# EasyEDA Pro project ProProject_PetCareSTM32_MiniSTM32_2024-08-29_1.epro

# Schematic Schematic1
Create Date: 2024-08-11; Page Name: P1; Project Name: PetCareSTM32_MiniSTM32; Schematic Name: Schematic1; Update Date: 2024-08-25; Company: 嘉立创EDA; Page Size: A4; Version: V1.0
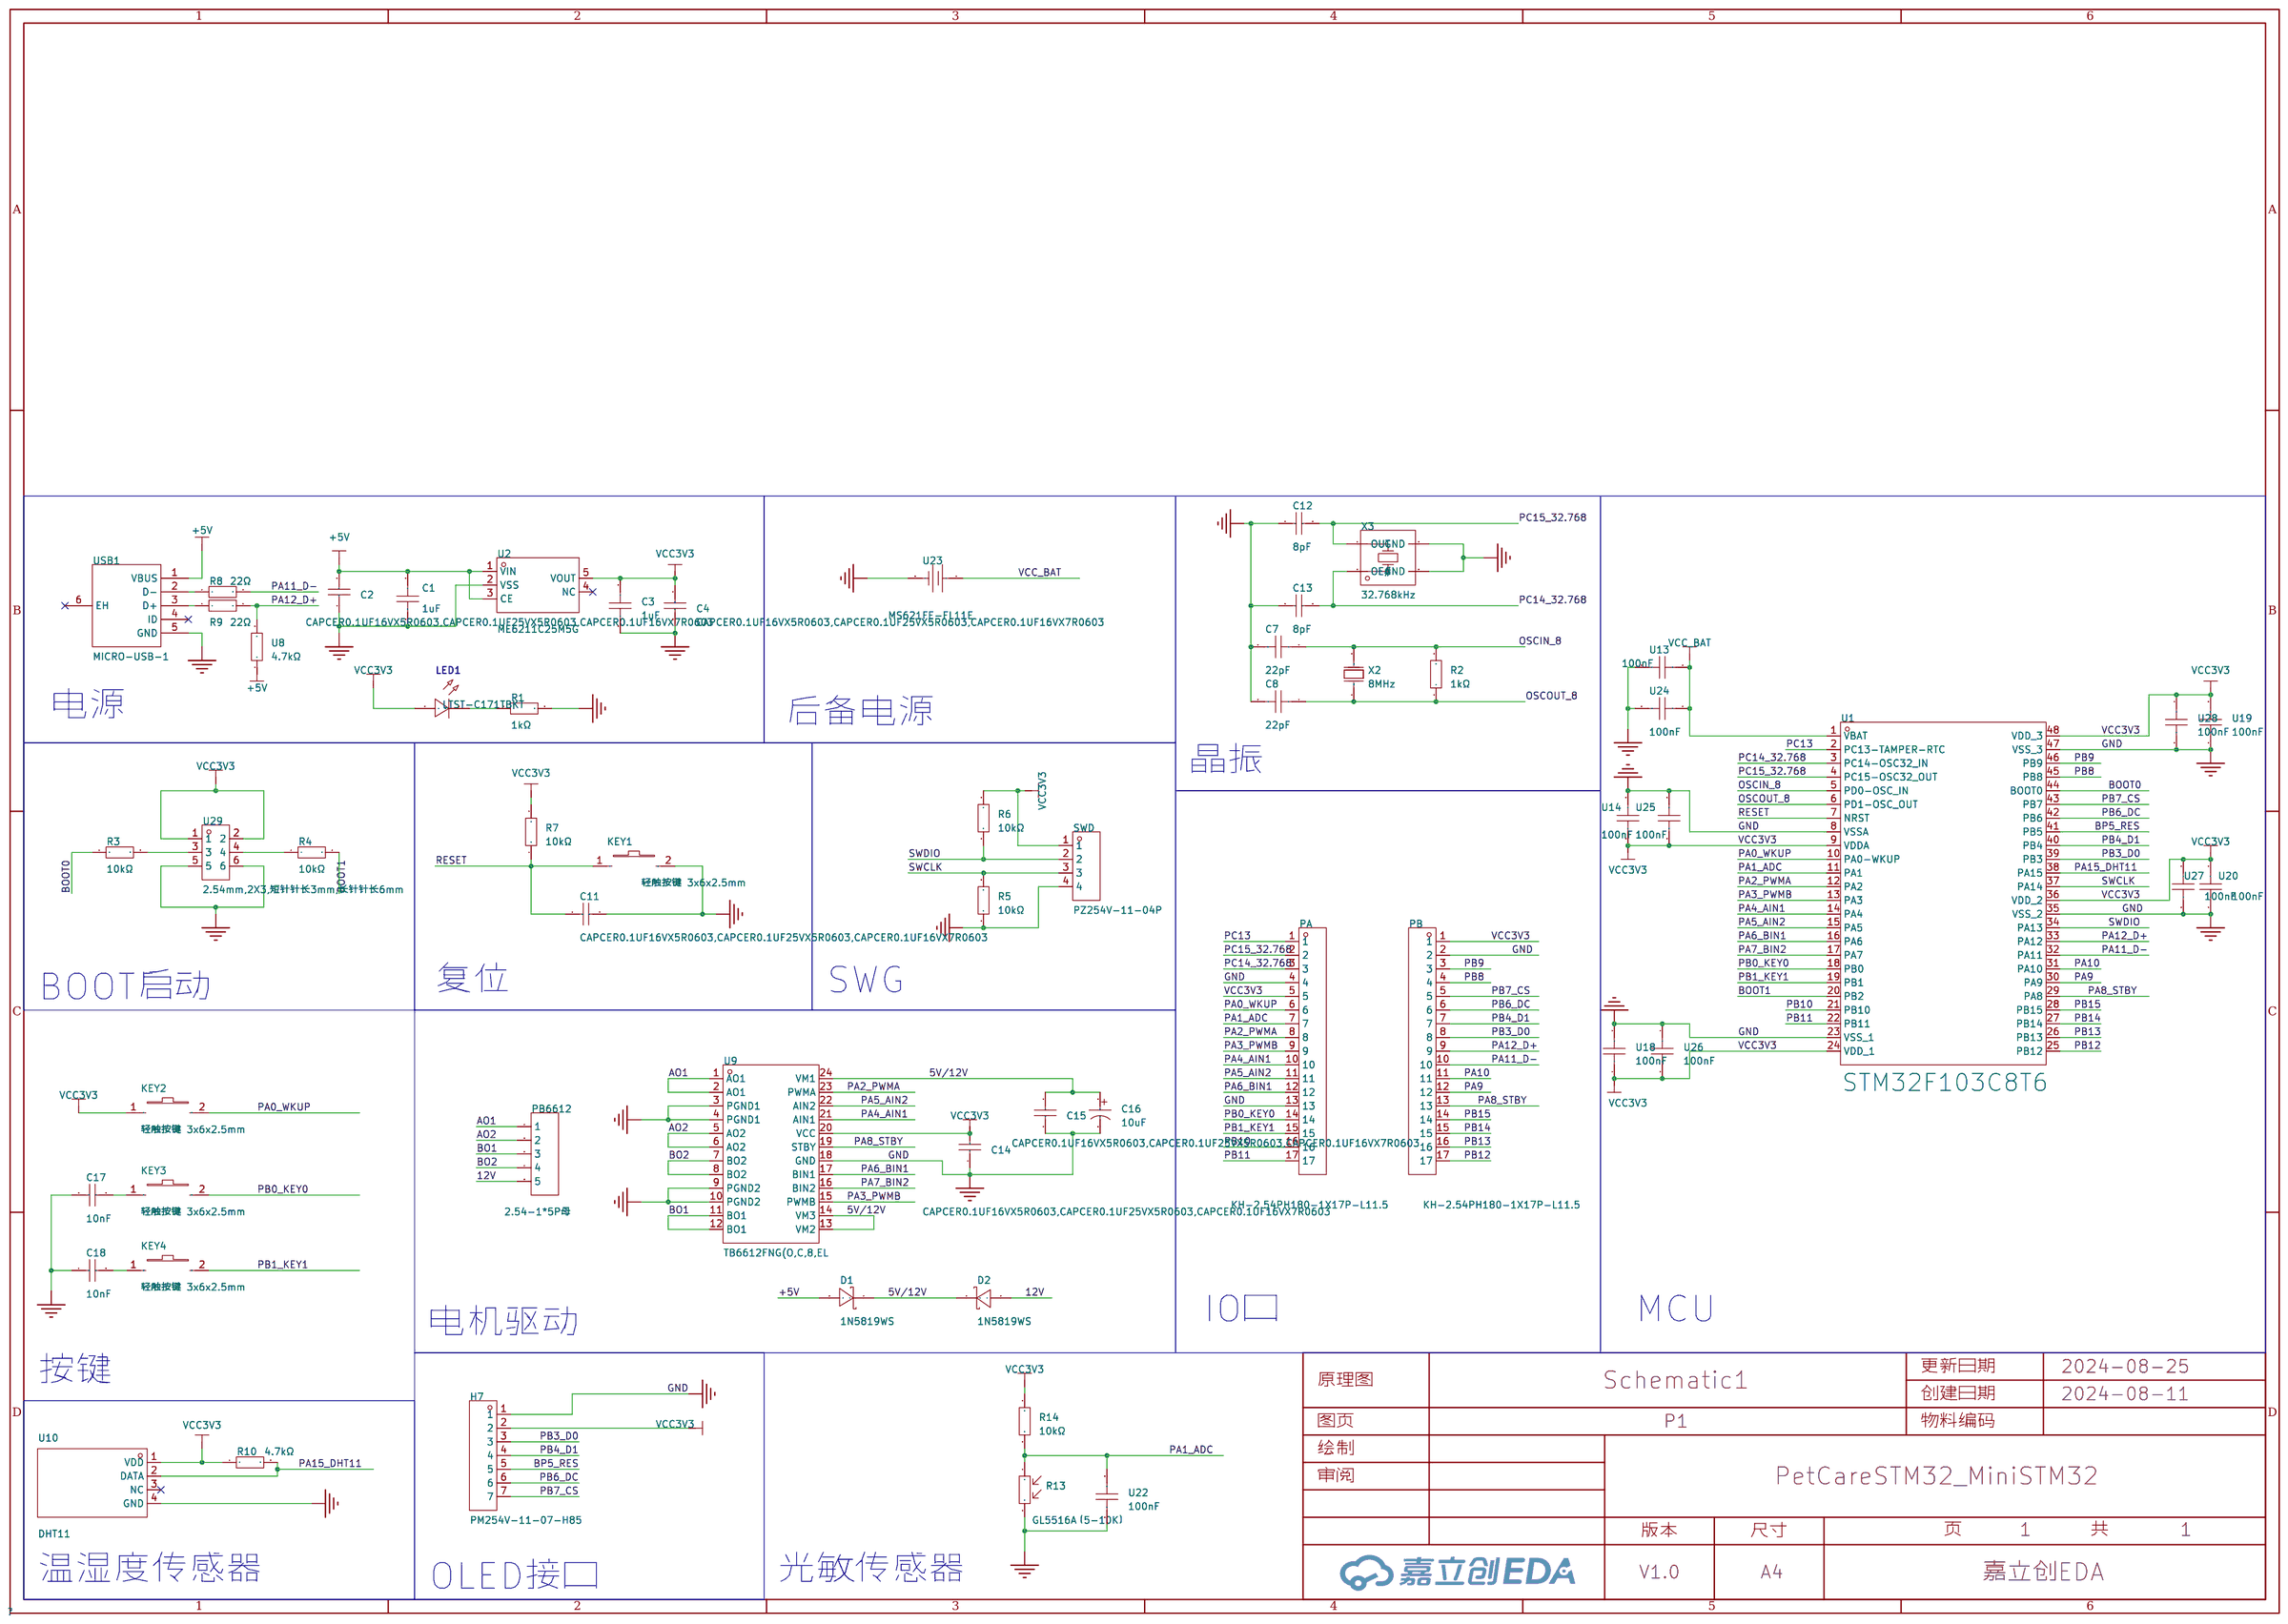
[diagram p0: schematic sheet]

## Parts
C1  1uF  [C0603]
C2  CAPCER0.1UF16VX5R0603,CAPCER0.1UF25VX5R0603,CAPCER0.1UF16VX7R0603  [C0603]
C3  1uF  [C0603]
C4  CAPCER0.1UF16VX5R0603,CAPCER0.1UF25VX5R0603,CAPCER0.1UF16VX7R0603  [C0603]
C7  22pF  [C0603]
C8  22pF  [C0603]
C11  CAPCER0.1UF16VX5R0603,CAPCER0.1UF25VX5R0603,CAPCER0.1UF16VX7R0603  [C0603]
C12  8pF  [C0603]
C13  8pF  [C0603]
C14  CAPCER0.1UF16VX5R0603,CAPCER0.1UF25VX5R0603,CAPCER0.1UF16VX7R0603  [C0603]
C15  CAPCER0.1UF16VX5R0603,CAPCER0.1UF25VX5R0603,CAPCER0.1UF16VX7R0603  [C0603]
C16  10uF  [CAP-TH_BD5.0-P2.00-D0.8-FD]
C17  10nF  [C0603]
C18  10nF  [C0603]
D1  1N5819WS  [SOD-323_L1.8-W1.3-LS2.5-RD]
D2  1N5819WS  [SOD-323_L1.8-W1.3-LS2.5-RD]
H7  PM254V-11-07-H85  [HDR-TH_7P-P2.54-V-F]
KEY1  轻触按键 3x6x2.5mm  [SW-SMD_L6.0-W3.6-LS8.0]
KEY2  轻触按键 3x6x2.5mm  [SW-SMD_L6.0-W3.6-LS8.0]
KEY3  轻触按键 3x6x2.5mm  [SW-SMD_L6.0-W3.6-LS8.0]
KEY4  轻触按键 3x6x2.5mm  [SW-SMD_L6.0-W3.6-LS8.0]
LED1  LTST-C171TBKT  [LED0805-RD_BLUE]
PA  KH-2.54PH180-1X17P-L11.5  [HDR-TH_17P-P2.54-V-M]
PB  KH-2.54PH180-1X17P-L11.5  [HDR-TH_17P-P2.54-V-M]
PB6612  2.54-1*5P母  [HDR-TH_5P-P2.54-V-F]
R1  1kΩ  [R0603]
R2  1kΩ  [R0603]
R3  10kΩ  [R0603]
R4  10kΩ  [R0603]
R5  10kΩ  [R0603]
R6  10kΩ  [R0603]
R7  10kΩ  [R0603]
R8  22Ω  [R0805]
R9  22Ω  [R0805]
R10  4.7kΩ  [R1206]
R13  GL5516A（5-10K）  [RES-TH_L5.1-W4.3-P3.40_GL55]
R14  10kΩ  [R0603]
SWD  PZ254V-11-04P  [HDR-TH_4P-P2.54-V-M]
U1  STM32F103C8T6  [LQFP-48_L7.0-W7.0-P0.50-LS9.0-BL]
U2  ME6211C25M5G  [SOT-23-5_L2.9-W1.7-P0.95-LS2.8-BL]
U8  4.7kΩ  [R0603]
U9  TB6612FNG(O,C,8,EL  [SSOP-24_L8.4-W5.8-P0.65-LS7.8-BL]
U10  DHT11  [SENSOR-TH_DHT11]
U13  100nF  [C0603]
U14  100nF  [C0603]
U18  100nF  [C0603]
U19  100nF  [C0603]
U20  100nF  [C0603]
U22  100nF  [C0603]
U23  MS621FE-FL11E  [BAT-SMD_FL11E]
U24  100nF  [C0603]
U25  100nF  [C0603]
U26  100nF  [C0603]
U27  100nF  [C0603]
U28  100nF  [C0603]
U29  2.54mm,2X3,短针针长3mm,长针针长6mm  [HDR-TH_6P-P2.54-V-M-R2-C3-S2.54-2]
USB1  MICRO-USB-1  [MICRO-USB-SMD_C9900008946]
X2  8MHz  [OSC-SMD_L5.0-W3.2]
X3  32.768kHz  [CRYSTAL-SMD_4P-L8.0-W3.8-BL]

## Library data of the parts
C1 C3 = CL10A105KB8NNNC: 容值:1uF;精度:±10%;额定电压:50V;材质(温度系数):X5R;; LCSC Part Name: 1uF ±10% 50V; Supplier Part: C15849; Manufacturer: SAMSUNG(三星); Supplier Footprint: 0603; JLCPCB Part Class: Basic Part; Datasheet: https://atta.szlcsc.com/upload/public/pdf/source/20160218/1457707763339.pdf; Supplier: LCSC; Tolerance: ±10%; Voltage Rated: 50V; Temperature Coefficient: X5R
C2 C4 C11 C14 C15 = CAPCER0.1UF16VX5R0603,CAPCER0.1UF25VX5R0603,CAPCER0.1UF16VX7R0603: Supplier Part: C9900012833; JLCPCB Part Class: Extended Part; Supplier: LCSC
C7 C8 = CL10C220JB81PNC: 容值:22pF;精度:±5%;额定电压:50V;材质(温度系数):C0G;; LCSC Part Name: 22pF ±5% 50V; Supplier Part: C170132; Manufacturer: SAMSUNG(三星); Supplier Footprint: 0603; JLCPCB Part Class: Extended Part; Datasheet: https://atta.szlcsc.com/upload/public/pdf/source/20180126/C170132_15169630833661310807.pdf; Supplier: LCSC; Tolerance: ±5%; Voltage Rated: 50V; Temperature Coefficient: C0G
C12 C13 = 0603CG8R0C500NT: 容值:8pF;额定电压:50V;材质(温度系数):C0G;; LCSC Part Name: 8pF 50V; Supplier Part: C36508; Manufacturer: FH(风华); Supplier Footprint: 0603; JLCPCB Part Class: Extended Part; Datasheet: https://atta.szlcsc.com/upload/public/pdf/source/20200305/C486355_26A10D38EF8C2A5C37091D0039909270.pdf; Supplier: LCSC; Voltage Rated: 50V; Temperature Coefficient: C0G
C16 = KF100M025C110A: 容值:10uF;精度:±20%;额定电压:25V;; LCSC Part Name: 10uF ±20% 25V; Supplier Part: C62930; Manufacturer: CapXon(丰宾); Supplier Footprint: 插件,D5xL11mm; JLCPCB Part Class: Extended Part; Datasheet: https://atta.szlcsc.com/upload/public/pdf/source/20160702/1467448308274.pdf; Supplier: LCSC; Tolerance: ±20%; Rated Voltage: 25V; Lead Spacing: 2mm; φD: 5mm; L: 11mm; Lifetime @ Temp: 2000hrs@105℃
C17 C18 = CC0603KRX7R9BB103: 容值:10nF;精度:±10%;额定电压:50V;材质(温度系数):X7R;; LCSC Part Name: 10nF ±10% 50V; Supplier Part: C100042; Manufacturer: YAGEO(国巨); Supplier Footprint: 0603; JLCPCB Part Class: Extended Part; Datasheet: https://atta.szlcsc.com/upload/public/pdf/source/20181008/C309510_22F155564471FAF6A489F7D68F34234E.pdf; Supplier: LCSC; Tolerance: ±10%; Voltage Rated: 50V; Temperature Coefficient: X7R
D1 D2 = 1N5819WS_C191023: 正向压降(Vf):600mV@1A;直流反向耐压(Vr):40V;平均整流电流(Io):1A;; LCSC Part Name: 电压:40V 电流:1A; Supplier Part: C191023; Manufacturer: Hottech(合科泰); Supplier Footprint: SOD-323; JLCPCB Part Class: Basic Part; Datasheet: https://atta.szlcsc.com/upload/public/pdf/source/20220428/3CB86FD8D28D653594B4E35F9D5AEFD9.pdf; Supplier: LCSC; Forward Voltage (Vf@If): 600mV@1A; Reverse Voltage (Vr): 40V; Average Rectified Current (Io): 1A
H7 = PM254V-11-07-H85: 插孔结构:1x7P;间距:2.54mm;行距:-;圆孔/方孔:方孔;安装类型:直插;排数:单排;总孔位数:7P;额定电流:3A;额定电压:250V;插孔方向:顶部;塑高:-;工作温度范围:-40℃~+105℃;; LCSC Part Name: 间距:2.54mm 1x7P 直插; Supplier Part: C2832270; Manufacturer: XFCN(兴飞); Supplier Footprint: 插件,P=2.54mm; JLCPCB Part Class: Extended Part; Datasheet: https://atta.szlcsc.com/upload/public/pdf/source/20210514/C2832270_F424CC0071A81298BFB56B53406F9842.pdf; Supplier: LCSC; Holes Structure: 1x7P; Pitch: 2.54mm; Circular Hole / Square Hole: 方孔; Mounting Type: 直插; Number of Rows: 单排; Number of Holes: 7P; Current Rating (Max): 3A; Voltage Rating (Max): 250V; Holes Direction: 顶部; Operating Temperature Range: -40℃~+105℃
KEY1-KEY4 = 轻触按键 3x6x2.5mm: LCSC Part Name: 3x6x2.5 红头 耐高温; Supplier Part: C5382; Supplier Footprint: SMD; JLCPCB Part Class: Extended Part; Supplier: LCSC
LED1 = LTST-C171TBKT: 发光颜色:蓝色;正向电压(VF):3.3V;功率:76mW;正向电流:20mA;主波长:465nm~475nm;二极管配置:-;透镜颜色:无色透明透镜;色温:-;发光强度:104mcd;发光角度:130°;载带方式:-;工作温度:-20℃~+80℃;; LCSC Part Name: 蓝灯; Supplier Part: C98225; Manufacturer: LITEON(光宝); Supplier Footprint: 0805; JLCPCB Part Class: Extended Part; Datasheet: https://atta.szlcsc.com/upload/public/pdf/source/20170818/C98225_1503051350955895434.pdf; Supplier: LCSC; Emitted Color: 蓝色; Forward Voltage (VF): 3.3V; Power Dissipation: 76mW; Forward Current: 20mA; Dominant Wavelength: 465nm~475nm; Peak Wavelength: 468nm; Lens Color: 无色透明透镜; Luminous Intensity: 104mcd; Viewing Angle: 130°; Operating Temperature: -20℃~+80℃
PA PB = KH-2.54PH180-1X17P-L11.5: 插针结构:1x17P;间距:2.54mm;行距:-;圆针/方针:方针;安装类型:直插;排数:单排;总PIN位数:17P;额定电流:3A;额定电压:-;配合针长度:6mm;塑高:2.5mm;端接针长度:3mm;工作温度范围:-40℃~+105℃;颜色:黑色;; LCSC Part Name: 间距:2.54mm 1x17P 直插 方针; Supplier Part: C2932705; Manufacturer: kinghelm(金航标); Supplier Footprint: 插件,P=2.54mm; JLCPCB Part Class: Extended Part; Datasheet: https://atta.szlcsc.com/upload/public/pdf/source/20211220/20932CDD9C2552710798341E35ADE8E4.pdf; Supplier: LCSC; Pin Structure: 1x17P; Pitch: 2.54mm; Circluar Pins/Square Pins: 方针; Mounting Type: 直插; Number of Rows: 单排; Number of Pins: 17P; Current Rating (Max): 3A; Length of Mating Pin: 6mm; Insulation Height: 2.5mm; Length of End Connection Pin: 3mm; Operating Temperature Range: -40℃~+105℃; Color: 黑色
PB6612 = 2.54-1*5P母: 插孔结构:1x5P;间距:2.54mm;行距:-;安装类型:直插;排数:单排;总孔位数:5P;塑高:-;触头材质:-;触头镀层:-;; LCSC Part Name: 间距:2.54mm 1x5P 直插; Supplier Part: C50950; Manufacturer: BOOMELE(博穆精密); Supplier Footprint: 插件,P=2.54mm; JLCPCB Part Class: Extended Part; Datasheet: https://atta.szlcsc.com/upload/public/pdf/source/20210301/C2718488_F4427B881E42CAA8DDB0B1C12B3A522C.pdf; Supplier: LCSC; Holes Structure: 1x5P; Pitch: 2.54mm; Mounting Type: 直插; Number of Rows: 单排; Number of Holes: 5P
R1 = RC0603FR-071KL: 电阻类型:厚膜电阻;阻值:1kΩ;精度:±1%;功率:100mW;最大工作电压:75V;温度系数:±100ppm/℃;; LCSC Part Name: 厚膜电阻 1kΩ ±1% 100mW; Supplier Part: C22548; Manufacturer: YAGEO(国巨); Supplier Footprint: 0603; JLCPCB Part Class: Extended Part; Datasheet: https://atta.szlcsc.com/upload/public/pdf/source/20180316/70C0E2BDAE7FCC62C531A5A58D202EE1.pdf; Supplier: LCSC; Type: 厚膜电阻; Tolerance: ±1%; Power(Watts): 100mW; Overload Voltage (Max): 75V; Temperature Coefficient: ±100ppm/℃; Operating Temperature Range: -55℃~+155℃
R2 = 0603WAD1001T5E: 电阻类型:厚膜电阻;阻值:1kΩ;精度:±0.5%;功率:100mW;最大工作电压:75V;温度系数:±100ppm/℃;; LCSC Part Name: 1kΩ ±0.5% 100mW 厚膜电阻; Supplier Part: C51218; Manufacturer: UNI-ROYAL(厚声); Supplier Footprint: 0603; JLCPCB Part Class: Extended Part; Datasheet: https://atta.szlcsc.com/upload/public/pdf/source/20200306/C422600_1E6D84923E4A46A82E41ADD87F860B5C.pdf; Supplier: LCSC; Type: 厚膜电阻; Tolerance: ±0.5%; Power(Watts): 100mW; Overload Voltage (Max): 75V; Temperature Coefficient: ±100ppm/℃; Operating Temperature Range: -55℃~+155℃
R3-R7 R14 = 0603WAF1002T5E: 电阻类型:厚膜电阻;阻值:10kΩ;精度:±1%;功率:100mW;最大工作电压:75V;温度系数:±100ppm/℃;; LCSC Part Name: 厚膜电阻 10kΩ ±1% 100mW; Supplier Part: C25804; Manufacturer: UNI-ROYAL(厚声); Supplier Footprint: 0603; JLCPCB Part Class: Basic Part; Datasheet: https://atta.szlcsc.com/upload/public/pdf/source/20200306/C422600_1E6D84923E4A46A82E41ADD87F860B5C.pdf; Supplier: LCSC; Type: 厚膜电阻; Tolerance: ±1%; Power(Watts): 100mW; Overload Voltage (Max): 75V; Temperature Coefficient: ±100ppm/℃; Operating Temperature Range: -55℃~+155℃
R8 R9 = TC0525F220JT5E: 电阻类型:薄膜电阻;阻值:22Ω;精度:±1%;功率:250mW;最大工作电压:150V;温度系数:±25ppm/℃;; LCSC Part Name: 22Ω ±1% 250mW 薄膜电阻; Supplier Part: C65068; Manufacturer: UNI-ROYAL(厚声); Supplier Footprint: 0805; JLCPCB Part Class: Extended Part; Datasheet: https://atta.szlcsc.com/upload/public/pdf/source/20190904/C425668_F2F639A313B6F33D501F342892FD5229.pdf; Supplier: LCSC; Type: 薄膜电阻; Tolerance: ±1%; Power(Watts): 250mW; Overload Voltage (Max): 150V; Temperature Coefficient: ±25ppm/℃; Operating Temperature Range: -55℃~+155℃
R10 = 1206W4F4701T5E: 电阻类型:厚膜电阻;阻值:4.7kΩ;精度:±1%;功率:250mW;最大工作电压:200V;温度系数:±100ppm/℃;; LCSC Part Name: 4.7kΩ ±1% 250mW 厚膜电阻; Supplier Part: C17936; Manufacturer: UNI-ROYAL(厚声); Supplier Footprint: 1206; JLCPCB Part Class: Basic Part; Datasheet: https://atta.szlcsc.com/upload/public/pdf/source/20200306/C422600_1E6D84923E4A46A82E41ADD87F860B5C.pdf; Supplier: LCSC; Type: 厚膜电阻; Tolerance: ±1%; Power(Watts): 250mW; Overload Voltage (Max): 200V; Temperature Coefficient: ±100ppm/℃; Operating Temperature Range: -55℃~+155℃
R13 = GL5516A（5-10K）: 暗电阻:200kΩ;亮电阻 @ 10Lux:5kΩ~10kΩ;光谱峰值(波长):540nm;; LCSC Part Name: 亮电阻:5kΩ~10kΩ 暗电阻:200kΩ; Supplier Part: C11307; Manufacturer: JCHL(晶创和立); Supplier Footprint: 插件,P=3.4mm; JLCPCB Part Class: Extended Part; Datasheet: https://atta.szlcsc.com/upload/public/pdf/source/20200417/C515010_C10502EF7F431E893A7F20DB83F527F0.pdf; Supplier: LCSC; Dark Resistance: 200kΩ; Illuminated Resistance @ 10Lux: 5kΩ~10kΩ; Applied Voltage: 150V; Spectral Peak: 540nm
SWD = PZ254V-11-04P: 插针结构:1x4P;间距:2.54mm;行距:-;圆针/方针:方针;安装类型:直插;排数:单排;总PIN位数:4P;额定电流:3A;额定电压:250V;配合针长度:6mm;塑高:2.5mm;端接针长度:3mm;触头材质:-;工作温度范围:-40℃~+105℃;颜色:黑色;; LCSC Part Name: 间距:2.54mm 1x4P 直插 方针; Supplier Part: C2691448; Manufacturer: XFCN(兴飞); Supplier Footprint: 插件,P=2.54mm; JLCPCB Part Class: Extended Part; Datasheet: https://atta.szlcsc.com/upload/public/pdf/source/20200309/C492403_F9F19131791D08044AD4F84F8E751A34.pdf; Supplier: LCSC; Pin Structure: 1x4P; Pitch: 2.54mm; Circluar Pins/Square Pins: 方针; Mounting Type: 直插; Number of Rows: 单排; Number of Pins: 4P; Current Rating (Max): 3A; Voltage Rating (Max): 250V; Length of Mating Pin: 6mm; Insulation Height: 2.5mm; Length of End Connection Pin: 3mm; Operating Temperature Range: -40℃~+105℃; Color: 黑色
U1 = STM32F103C8T6: CPU内核:ARM-M3;程序存储容量:64KB;RAM总容量:20KB;GPIO端口数量:37;工作电压范围:2V~3.6V;CPU最大主频:72MHz;程序存储器类型:FLASH;; LCSC Part Name: 主流增强型ARM Cortex-M3 MCU，具有64 KB Flash、72 MHz CPU、电机控制、USB和CAN; Supplier Part: C8734; Manufacturer: ST(意法半导体); Supplier Footprint: LQFP-48(7x7); JLCPCB Part Class: 扩展库; Datasheet: https://atta.szlcsc.com/upload/public/pdf/source/20220812/8363ACEC51AD55ECEB84799464F7CB85.pdf; Supplier: LCSC; CPU Core: ARM-M3; Program Storage Size: 64KB; RAM Size: 20KB; GPIO Ports Number: 37; Operating Voltage Range: 2V~3.6V; CPU Maximum Speed: 72MHz; Program Memory Type: FLASH; Operating Temperature Range: -40℃~+85℃; ADC (Bit): 12bit; Universal Serial Bus: 有; Peripheral/Function: 看门狗；DMA；看门狗；温度传感器; Watchdog: 有; Infrared Data Association: 有; Low-Voltage Detect: 有; Direct Memory Access: 有; Internal Oscillator: 有
U2 = ME6211C25M5G: LCSC Part Name: ME6211C25M5G 停产; Supplier Part: C2835813; Manufacturer: MICRONE(南京微盟); Supplier Footprint: SOT-23-5; JLCPCB Part Class: Extended Part; Datasheet: https://atta.szlcsc.com/upload/public/pdf/source/20211210/ACC7C3E9BA56F250BF966425916E32B9.pdf; Supplier: LCSC
U8 = AR03FTDX4701A: 电阻类型:薄膜电阻;阻值:4.7kΩ;精度:±1%;功率:100mW;最大工作电压:75V;温度系数:±50ppm/℃;; LCSC Part Name: 薄膜电阻 4.7kΩ ±1% 100mW; Supplier Part: C2924150; Manufacturer: Viking(光颉); Supplier Footprint: 0603; JLCPCB Part Class: Extended Part; Datasheet: https://atta.szlcsc.com/upload/public/pdf/source/20211123/7AFDB03DAF68AA91648A852AAE26A3AB.pdf; Supplier: LCSC; Type: 薄膜电阻; Tolerance: ±1%; Power(Watts): 100mW; Overload Voltage (Max): 75V; Temperature Coefficient: ±50ppm/℃; Operating Temperature Range: -55℃~+155℃
U9 = TB6612FNG(O,C,8,EL: 双直流电机驱动器集成电路; Supplier Part: C88224; Manufacturer: TOSHIBA(东芝); Supplier Footprint: SSOP-24-208mil; JLCPCB Part Class: Extended Part; Datasheet: https://atta.szlcsc.com/upload/public/pdf/source/20171128/C141517_15118625624231147036.pdf; Supplier: LCSC
U10 = DHT11: 新款电容式数字温湿度传感器,老款已停产16.1x12.6x5.8mm; LCSC Part Name: DHT11  电容式传感器; Supplier Part: C117051; Manufacturer: 广州奥松; Supplier Footprint: SIP-4; JLCPCB Part Class: Extended Part; Datasheet: https://atta.szlcsc.com/upload/public/pdf/source/20170703/1499081238365.pdf; Supplier: LCSC
U13 U14 U18-U20 U22 U24-U28 = CGA0603X7R104K500JT: 容值:100nF;精度:±10%;额定电压:50V;材质(温度系数):X7R;; LCSC Part Name: 100nF ±10% 50V; Supplier Part: C6119867; Manufacturer: HRE(芯声); Supplier Footprint: 0603; JLCPCB Part Class: Extended Part; Supplier: LCSC; Tolerance: ±10%; Voltage Rated: 50V; Temperature Coefficient: X7R
U23 = MS621FE-FL11E: FL11E 3.3V可充电纽扣电池 5.5mAH; LCSC Part Name: Seiko/精工，可充电纽扣电池，3V，MS621FE-FL11E，1个; Supplier Part: C80909; Manufacturer: Seiko(精工); JLCPCB Part Class: Extended Part; Datasheet: https://atta.szlcsc.com/upload/public/pdf/source/20230719/88F2811CC6B30DD05F1C5A5953BF9E77.pdf; Supplier: LCSC; voltage: 3 V; capacity: 5.5mAh; chemical composition: 锂离子; temperature range: -20-60°C; type: 纽扣; characteristic: 可充电; Packaging quantity: 1; Battery capacity: -；-；-
U29 = 2.54mm,2X3,短针针长3mm,长针针长6mm: Supplier Part: C9900024418; Supplier Footprint: 2X3; JLCPCB Part Class: Extended Part; Supplier: LCSC
USB1 = MICRO-USB-1: Supplier Part: C9900008946; Supplier Footprint: USB-micro; JLCPCB Part Class: Extended Part; Supplier: LCSC
X2 = ABM3-8.000MHZ-D2Y-T: 晶振类型:贴片晶振;频率:8MHz;常温频差:±20ppm;外接负载电容:18pF;频率稳定度(全温):±30ppm;; LCSC Part Name: 8MHz ±20ppm 18pF; Supplier Part: C144380; Manufacturer: ABRACON; Supplier Footprint: SMD5032; JLCPCB Part Class: Extended Part; Datasheet: https://atta.szlcsc.com/upload/public/pdf/source/20180613/C148313_0A3B1F233FF88ED3B220BE4C181ABF14.pdf; Supplier: LCSC; Crystal Type: 贴片晶振; Normal temperature Frequency Tolerance: ±20ppm; External load capacitor: 18pF; Frequency Stability(Full temperature range): ±30ppm; Equivalent Series Resistance (ESR): 140Ω; Operating Temperature: -40℃~+85℃
X3 = ABS25-32.768KHZ-T: 晶振类型:-;频率:32.768kHz;常温频差:±20ppm;外接负载电容:12.5pF;频率稳定度(全温):-;; LCSC Part Name: 32.768kHz ±20ppm 12.5pF; Supplier Part: C179637; Manufacturer: ABRACON; Supplier Footprint: MC-306; JLCPCB Part Class: 扩展库; Datasheet: https://atta.szlcsc.com/upload/public/pdf/source/20180207/C179637_15179896523281356363.pdf; Supplier: LCSC; Normal temperature Frequency Tolerance: ±20ppm; External load capacitor: 12.5pF; Equivalent Series Resistance (ESR): 50kΩ; Operating Temperature: -40℃~+85℃

## Nets
5V/12V: C15.2 C16.1 D1.1(K) D2.1(K) U9.13(VM2) U9.14(VM3) U9.24(VM1)
12V: D2.2(A) PB6612.5
+5V: C1.2 C2.2 D1.2(A) U2.1(VIN) U2.3(CE) U8.1 USB1.1(VBUS)
GND: C1.1 C2.1 C3.1 C4.1 C7.2 C8.2 C11.2 C12.1 C13.1 C14.1 C15.1 C16.2 C17.2 C18.1 H7.1 KEY1.2 PA.4 PA.13 PB.2 R1.2 R5.1 R13.2 SWD.4 U1.8(VSSA) U1.23(VSS_1) U1.35(VSS_2) U1.47(VSS_3) U2.2(VSS) U9.3(PGND1) U9.4(PGND1) U9.9(PGND2) U9.10(PGND2) U9.18(GND) U10.4(GND) U13.2 U14.2 U18.2 U19.1 U20.1 U22.1 U23.2(-) U24.2 U25.1 U26.1 U27.2 U28.2 U29.5 U29.6 USB1.5(GND) X3.2(GND) X3.3(GND)
VCC3V3: C3.2 C4.2 C14.2 H7.2 KEY2.1 LED1.2(A) PA.5 PB.1 R6.2 R7.2 R10.1 R14.2 SWD.1 U1.9(VDDA) U1.24(VDD_1) U1.36(VDD_2) U1.48(VDD_3) U2.5(VOUT) U9.20(VCC) U10.1(VDD) U14.1 U18.1 U19.2 U20.2 U25.2 U26.2 U27.1 U28.1 U29.1 U29.2
VCC_BAT: U1.1(VBAT) U13.1 U23.1(+) U24.1
AO1: PB6612.1 U9.1(AO1) U9.2(AO1)
AO2: PB6612.2 U9.5(AO2) U9.6(AO2)
BO1: PB6612.3 U9.11(BO1) U9.12(BO1)
BO2: PB6612.4 U9.7(BO2) U9.8(BO2)
BOOT0: R3.1 U1.44(BOOT0)
BOOT1: R4.2 U1.20(PB2)
BP5_RES: H7.5 U1.41(PB5)
OSCIN_8: C7.1 R2.2 U1.5(PD0-OSC_IN) X2.2(OSC2)
OSCOUT_8: C8.1 R2.1 U1.6(PD1-OSC_OUT) X2.1(OSC1)
PA0_WKUP: KEY2.2 PA.6 U1.10(PA0-WKUP)
PA1_ADC: PA.7 R13.1 R14.1 U1.11(PA1) U22.2
PA2_PWMA: PA.8 U1.12(PA2) U9.23(PWMA)
PA3_PWMB: PA.9 U1.13(PA3) U9.15(PWMB)
PA4_AIN1: PA.10 U1.14(PA4) U9.21(AIN1)
PA5_AIN2: PA.11 U1.15(PA5) U9.22(AIN2)
PA6_BIN1: PA.12 U1.16(PA6) U9.17(BIN1)
PA7_BIN2: U1.17(PA7) U9.16(BIN2)
PA8_STBY: PB.13 U1.29(PA8) U9.19(STBY)
PA9: PB.12 U1.30(PA9)
PA10: PB.11 U1.31(PA10)
PA11_D-: PB.10 R8.2 U1.32(PA11)
PA12_D+: PB.9 R9.2 U1.33(PA12) U8.2
PA15_DHT11: R10.2 U1.38(PA15) U10.2(DATA)
PB0_KEY0: KEY3.2 PA.14 U1.18(PB0)
PB1_KEY1: KEY4.2 PA.15 U1.19(PB1)
PB3_D0: H7.3 PB.8 U1.39(PB3)
PB4_D1: H7.4 PB.7 U1.40(PB4)
PB6_DC: H7.6 PB.6 U1.42(PB6)
PB7_CS: H7.7 PB.5 U1.43(PB7)
PB8: PB.4 U1.45(PB8)
PB9: PB.3 U1.46(PB9)
PB10: PA.16 U1.21(PB10)
PB11: PA.17 U1.22(PB11)
PB12: PB.17 U1.25(PB12)
PB13: PB.16 U1.26(PB13)
PB14: PB.15 U1.27(PB14)
PB15: PB.14 U1.28(PB15)
PC13: PA.1 U1.2(PC13-TAMPER-RTC)
PC14_32.768: C13.2 PA.3 U1.3(PC14-OSC32_IN) X3.1(OE#)
PC15_32.768: C12.2 PA.2 U1.4(PC15-OSC32_OUT) X3.4(OUT)
RESET: C11.1 KEY1.1 R7.1 U1.7(NRST)
SWCLK: R5.2 SWD.3 U1.37(PA14)
SWDIO: R6.1 SWD.2 U1.34(PA13)
$1N4524: LED1.1(C) R1.1
$1N8192: R8.1 USB1.2(D-)
$1N8237: R9.1 USB1.3(D+)
$1N32184: C17.1 KEY3.1
$1N32195: C18.2 KEY4.1
Net-(R3-2): R3.2 U29.3
Net-(R4-1): R4.1 U29.4

Not connected (* = marked no-connect by the designer): U2 4(NC)*; U10 3(NC)*; USB1 4(ID)* 6(EH)*

## Notes on the sheet
- 电源
- 后备电源
- 晶振
- BOOT启动
- 复位
- SWG
- IO口
- MCU
- 电机驱动
- 按键
- 温湿度传感器
- 光敏传感器
- OLED接口

# Board PCB1
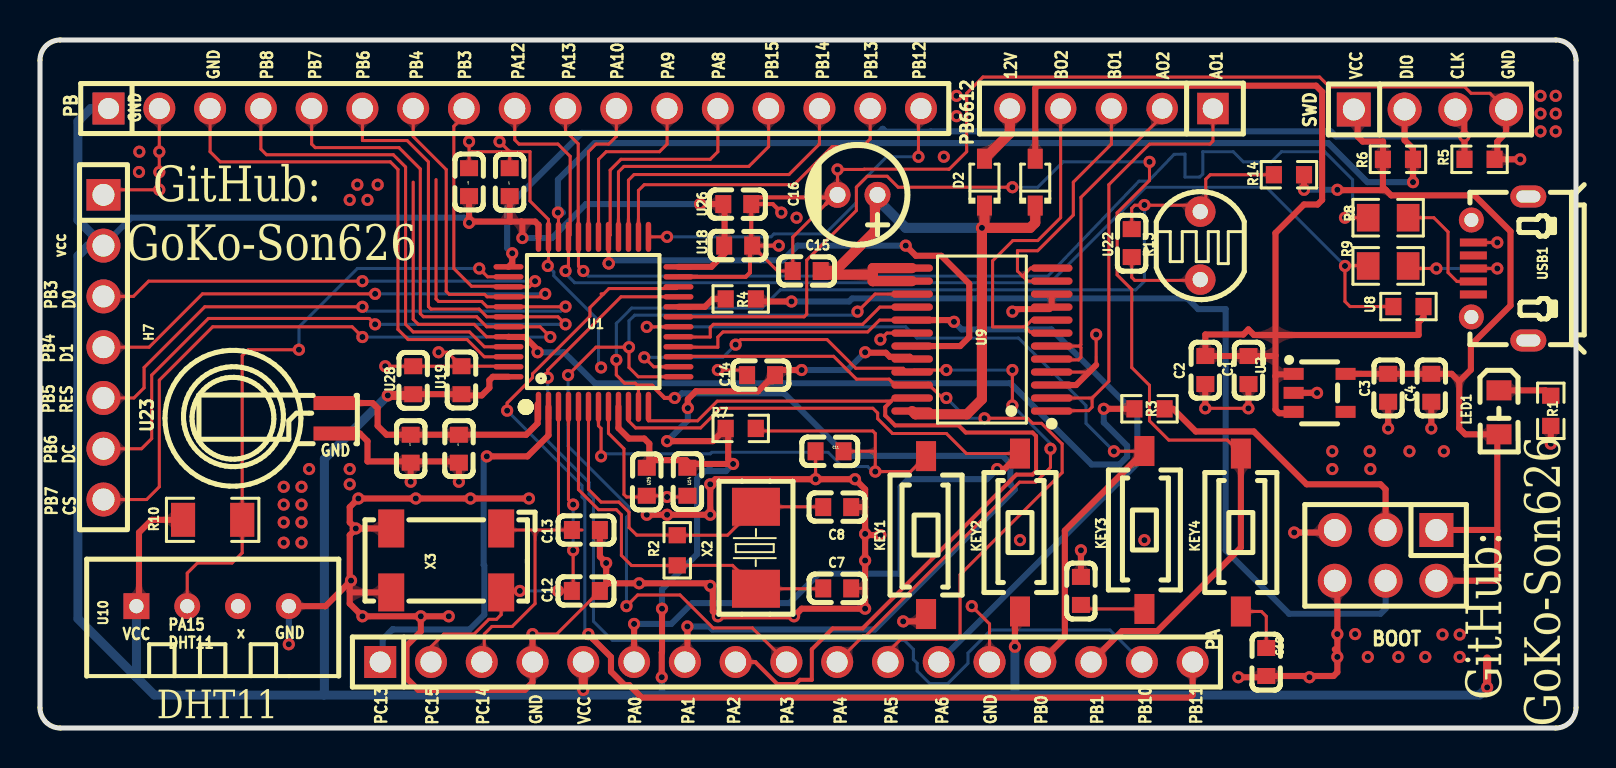
[diagram p1: board, top side]
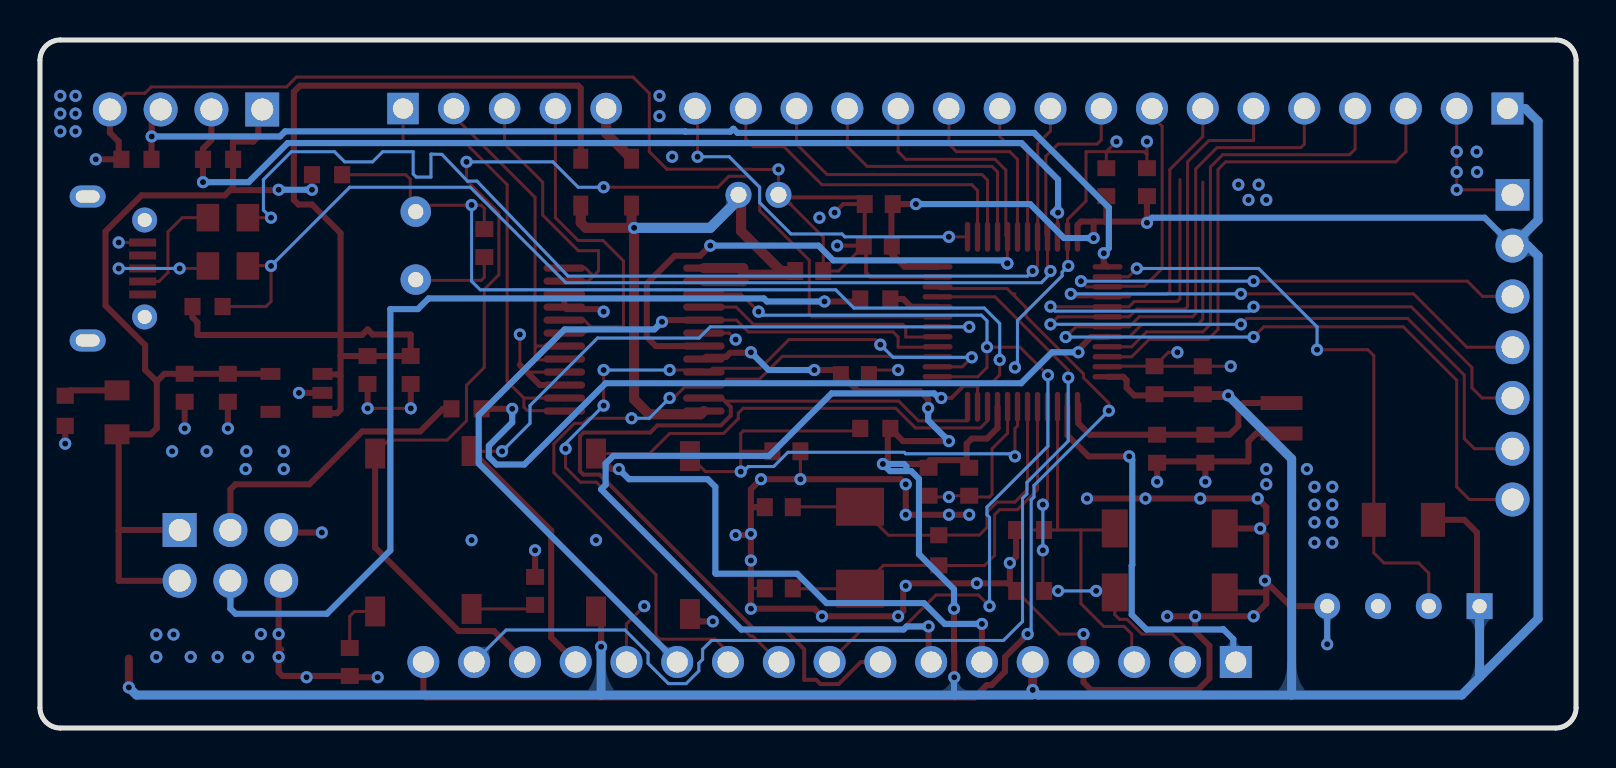
[diagram p2: board, bottom side, seen from below]

Outline 76.84 x 34.42 mm; copper layers: Top Layer, Bottom Layer. Coordinates in mm from the lower left corner of the outline.
Outline path: 0,33.4 0,1.02 arc(0.3,0.3) 1.02,0 75.82,0 arc(76.54,0.3) 76.84,1.02 76.84,33.4 arc(76.54,34.12) 75.82,34.42 1.02,34.42 arc(0.3,34.12) 0,33.4
Stack: Top Layer 0.035mm / Dielectric1 1.51mm FR4 er 4.5 / Bottom Layer 0.035mm

## Design rules (mm)
net PA11_D-: DP2
net PA12_D+: DP2
net $1N8192: DP1
net $1N8237: DP1
template: 自定义配置
spacing copperThickness1oz (default): track to track 0.203, other pairs 0.203 to 0.203
spacing copperThickness2oz: track to track 0.203, other pairs 0.152 to 0.3
track width copperThickness1oz (default): min 0.152, default 0.152, max 0.305
track width copperThickness2oz: min 0.203, default 0.254, max 2.54
track width 5V: min 0.305, default 0.305, max 0.762
track width 12V: min 0.508, default 0.508, max 0.762
differential pair differentialPair (default): width min 0.152, default 0.152, max 0.152; gap min 0.152, default 0.152
via viaSize (default): diameter min 0.61, default 0.61, max 0.61; hole min 0.305, default 0.305, max 0.305
net VCC_BAT uses 5V
net VCC3V3 uses 5V
net +5V uses 5V
net 5V/12V uses 12V
net 12V uses 12V

## Placement (name value [footprint] x y rotation side)
BOOT  2.54mm,2X3,短针针长3mm,长针针长6mm  [HDR-TH_6P-P2.54-V-M-R2-C3-S2.54-2]  67.31 8.64 180 top
C1  1uF  [C0603]  60.45 17.91 90 top
C2  CAPCER0.1UF16VX5R0603,CAPCER0.1UF25VX5R0603,CAPCER0.1UF16VX7R0603  [C0603]  58.29 17.91 90 top
C3  1uF  [C0603]  67.44 17.02 90 top
C4  CAPCER0.1UF16VX5R0603,CAPCER0.1UF25VX5R0603,CAPCER0.1UF16VX7R0603  [C0603]  69.6 17.02 90 top
C7  22pF  [C0603]  39.88 6.98 0 top
C8  22pF  [C0603]  39.88 11.05 0 top
C11  CAPCER0.1UF16VX5R0603,CAPCER0.1UF25VX5R0603,CAPCER0.1UF16VX7R0603  [C0603]  39.5 13.84 180 top
C12  8pF  [C0603]  27.31 6.86 180 top
C13  8pF  [C0603]  27.31 9.91 180 top
C14  CAPCER0.1UF16VX5R0603,CAPCER0.1UF25VX5R0603,CAPCER0.1UF16VX7R0603  [C0603]  36.07 17.65 0 top
C15  CAPCER0.1UF16VX5R0603,CAPCER0.1UF25VX5R0603,CAPCER0.1UF16VX7R0603  [C0603]  38.35 22.86 0 top
C16  10uF  [CAP-TH_BD5.0-P2.00-D0.8-FD]  40.89 26.67 180 top
C17  10nF  [C0603]  52.07 6.86 90 top
C18  10nF  [C0603]  61.34 3.3 90 top
D1  1N5819WS  [SOD-323_L1.8-W1.3-LS2.5-RD]  49.78 27.3 90 top
D2  1N5819WS  [SOD-323_L1.8-W1.3-LS2.5-RD]  47.24 27.3 90 top
H7  PM254V-11-07-H85  [HDR-TH_7P-P2.54-V-F]  3.17 19.05 270 top
KEY1  轻触按键 3x6x2.5mm  [SW-SMD_L6.0-W3.6-LS8.0]  44.32 9.65 270 top
KEY2  轻触按键 3x6x2.5mm  [SW-SMD_L6.0-W3.6-LS8.0]  49.02 9.78 90 top
KEY3  轻触按键 3x6x2.5mm  [SW-SMD_L6.0-W3.6-LS8.0]  55.25 9.91 90 top
KEY4  轻触按键 3x6x2.5mm  [SW-SMD_L6.0-W3.6-LS8.0]  60.07 9.78 90 top
LED1  LTST-C171TBKT  [LED0805-RD_BLUE]  72.98 15.79 270 top
PA  KH-2.54PH180-1X17P-L11.5  [HDR-TH_17P-P2.54-V-M]  37.34 3.3 0 top
PB  KH-2.54PH180-1X17P-L11.5  [HDR-TH_17P-P2.54-V-M]  23.75 30.99 0 top
PB6612  2.54-1*5P母  [HDR-TH_5P-P2.54-V-F]  53.59 30.99 180 top
R1  1kΩ  [R0603]  75.57 15.87 270 top
R2  1kΩ  [R0603]  31.88 8.89 270 top
R3  10kΩ  [R0603]  55.5 15.97 0 top
R4  10kΩ  [R0603]  35.05 21.46 180 top
R5  10kΩ  [R0603]  72.01 28.45 180 top
R6  10kΩ  [R0603]  67.93 28.45 180 top
R7  10kΩ  [R0603]  35.05 14.99 180 top
R8  22Ω  [R0805]  67.44 25.53 180 top
R9  22Ω  [R0805]  67.44 23.11 180 top
R10  4.7kΩ  [R1206]  8.64 10.41 0 top
R13  GL5516A（5-10K）  [RES-TH_L5.1-W4.3-P3.40_GL55]  58.04 24.13 0 top
R14  10kΩ  [R0603]  62.48 27.68 0 top
SWD  PZ254V-11-04P  [HDR-TH_4P-P2.54-V-M]  69.53 30.94 0 top
U1  STM32F103C8T6  [LQFP-48_L7.0-W7.0-P0.50-LS9.0-BL]  27.69 20.32 0 top
U2  ME6211C25M5G  [SOT-23-5_L2.9-W1.7-P0.95-LS2.8-BL]  64.01 16.76 270 top
U8  4.7kΩ  [R0603]  68.45 21.08 180 top
U9  TB6612FNG(O,C,8,EL  [SSOP-24_L8.4-W5.8-P0.65-LS7.8-BL]  47.12 19.43 90 top
U10  DHT11  [SENSOR-TH_DHT11]  8.64 6.1 0 top
U13  100nF  [C0603]  18.54 13.97 270 top
U14  100nF  [C0603]  32.38 12.32 270 top
U18  100nF  [C0603]  34.93 24.13 0 top
U19  100nF  [C0603]  21.08 17.4 270 top
U20  100nF  [C0603]  21.46 27.3 270 top
U22  100nF  [C0603]  54.61 24.26 90 top
U23  MS621FE-FL11E  [BAT-SMD_FL11E]  14.73 15.49 0 top
U24  100nF  [C0603]  20.96 13.97 270 top
U25  100nF  [C0603]  30.35 12.32 90 top
U26  100nF  [C0603]  34.88 26.21 180 top
U27  100nF  [C0603]  23.5 27.3 90 top
U28  100nF  [C0603]  18.67 17.4 90 top
USB1  MICRO-USB-1  [MICRO-USB-SMD_C9900008946]  73.03 22.99 90 top
X2  8MHz  [OSC-SMD_L5.0-W3.2]  35.81 9.02 270 top
X3  32.768kHz  [CRYSTAL-SMD_4P-L8.0-W3.8-BL]  20.32 8.38 180 top

## Footprints (pads in the part's own frame, mm; a bottom-side part is the same pattern mirrored in y, then rotated)
BAT-SMD_FL11E
  rect 2.1x0.7 smd: 1(0,0.762) 2(0,-0.762)
C0603
  rect 0.8x0.9 smd: 1(-0.7,0) 2(0.7,0)
CAP-TH_BD5.0-P2.00-D0.8-FD
  round 1.3 hole 0.8: 1(-1,0) 2(1,0)
CRYSTAL-SMD_4P-L8.0-W3.8-BL
  rect 1.3x1.9 smd: 1(-2.75,-1.6) 2(2.75,-1.6) 3(2.75,1.6) 4(-2.75,1.6)
HDR-TH_4P-P2.54-V-M
  rect 1.7x1.7 hole 1.1: 1(-3.81,0)
  round 1.7 hole 1.1: 2(-1.27,0) 3(1.27,0) 4(3.81,0)
HDR-TH_5P-P2.54-V-F
  rect 1.575x1.575 hole 1.02: 1(-5.08,0)
  round 1.575 hole 1.02: 2(-2.54,0) 3(0,0) 4(2.54,0) 5(5.08,0)
HDR-TH_6P-P2.54-V-M-R2-C3-S2.54-2
  rect 1.7x1.7 hole 1.1: 1(-2.54,-1.27)
  round 1.7 hole 1.1: 2(-2.54,1.27) 3(0,-1.27) 4(0,1.27) 5(2.54,-1.27) 6(2.54,1.27)
HDR-TH_7P-P2.54-V-F
  rect 1.575x1.7 hole 1.1: 1(-7.62,0)
  round 1.7 hole 1.1: 2(-5.08,0) 3(-2.54,0) 4(0,0) 5(2.54,0) 6(5.08,0) 7(7.62,0)
HDR-TH_17P-P2.54-V-M
  rect 1.6x1.6 hole 1.05: 1(-20.32,0)
  round 1.6 hole 1.05: 2(-17.78,0) 3(-15.24,0) 4(-12.7,0) 5(-10.16,0) 6(-7.62,0) 7(-5.08,0) 8(-2.54,0) 9(0,0) 10(2.54,0) 11(5.08,0) 12(7.62,0) 13(10.16,0) 14(12.7,0) 15(15.24,0) 16(17.78,0) 17(20.32,0)
LED0805-RD_BLUE
  rect 1x1.25 smd: 1(-1.1,0) 2(1.1,0)
LQFP-48_L7.0-W7.0-P0.50-LS9.0-BL
  oval 0.27x1.5 smd: 1(-2.75,-4.25) 2(-2.25,-4.25) 3(-1.75,-4.25) 4(-1.25,-4.25) 5(-0.75,-4.25) 6(-0.25,-4.25) 7(0.25,-4.25) 8(0.75,-4.25) 9(1.25,-4.25) 10(1.75,-4.25) 11(2.25,-4.25) 12(2.75,-4.25) 25(2.75,4.25) 26(2.25,4.25) 27(1.75,4.25) 28(1.25,4.25) 29(0.75,4.25) 30(0.25,4.25) 31(-0.25,4.25) 32(-0.75,4.25) 33(-1.25,4.25) 34(-1.75,4.25) 35(-2.25,4.25) 36(-2.75,4.25)
  oval 1.5x0.27 smd: 13(4.25,-2.75) 14(4.25,-2.25) 15(4.25,-1.75) 16(4.25,-1.25) 17(4.25,-0.75) 18(4.25,-0.25) 19(4.25,0.25) 20(4.25,0.75) 21(4.25,1.25) 22(4.25,1.75) 23(4.25,2.25) 24(4.25,2.75) 37(-4.25,2.75) 38(-4.25,2.25) 39(-4.25,1.75) 40(-4.25,1.25) 41(-4.25,0.75) 42(-4.25,0.25) 43(-4.25,-0.25) 44(-4.25,-0.75) 45(-4.25,-1.25) 46(-4.25,-1.75) 47(-4.25,-2.25) 48(-4.25,-2.75)
MICRO-USB-SMD_C9900008946
  rect 0.4x1.35 smd: 1(-1.3,1.325) 2(-0.65,1.325) 3(0,1.325) 4(0.65,1.325) 5(1.3,1.325)
  oval 1.1x1.8 hole 0.6x1.2: 6(-3.6,-1.425) 6(3.6,-1.425)
  round 1.25 hole 0.7: 6(-2.425,1.425) 6(2.425,1.425)
OSC-SMD_L5.0-W3.2
  rect 1.9x2.4 smd: 1(-2.05,0) 2(2.05,0)
R0603
  rect 0.806x0.864 smd: 1(-0.753,0) 2(0.753,0)
R0805
  rect 1.133x1.377 smd: 1(-1,0) 2(1,0)
R1206
  rect 1.208x1.701 smd: 1(-1.479,0) 2(1.479,0)
RES-TH_L5.1-W4.3-P3.40_GL55
  round 1.524 hole 0.762: 1(0,1.7) 2(0,-1.7)
SENSOR-TH_DHT11
  rect 1.296x1.296 hole 0.711: 1(-3.81,0)
  round 1.296 hole 0.711: 2(-1.27,0) 3(1.27,0) 4(3.81,0)
SOD-323_L1.8-W1.3-LS2.5-RD
  rect 1x0.75 smd: 1(-1.173,0) 2(1.173,0)
SOT-23-5_L2.9-W1.7-P0.95-LS2.8-BL
  rect 0.6x1 smd: 1(-0.95,-1.3) 2(0,-1.3) 3(0.95,-1.3) 4(0.95,1.3) 5(-0.95,1.3)
SSOP-24_L8.4-W5.8-P0.65-LS7.8-BL
  oval 0.364x2.082 smd: 1(-3.575,-3.491) 2(-2.925,-3.491) 3(-2.275,-3.491) 4(-1.625,-3.491) 5(-0.975,-3.491) 6(-0.325,-3.491) 7(0.325,-3.491) 8(0.975,-3.491) 9(1.625,-3.491) 10(2.275,-3.491) 11(2.925,-3.491) 12(3.575,-3.491) 13(3.575,3.491) 14(2.925,3.491) 15(2.275,3.491) 16(1.625,3.491) 17(0.975,3.491) 18(0.325,3.491) 19(-0.325,3.491) 20(-0.975,3.491) 21(-1.625,3.491) 22(-2.275,3.491) 23(-2.925,3.491) 24(-3.575,3.491)
SW-SMD_L6.0-W3.6-LS8.0
  rect 1.5x1 smd: 1(-3.95,0) 2(3.95,0)

## Nets
As in the schematic, except:
GND: BOOT.5 BOOT.6 C1.1 C2.1 C3.1 C4.1 C7.2 C8.2 C11.2 C12.1 C13.1 C14.1 C15.1 C16.2 C17.2 C18.1 H7.1 KEY1.2 PA.4 PA.13 PB.2 R1.2 R5.1 R13.2 SWD.4 U1.8 U1.23 U1.35 U1.47 U2.2 U9.3 U9.4 U9.9 U9.10 U9.18 U10.4 U13.2 U14.2 U18.2 U19.1 U20.1 U22.1 U23.2 U24.2 U25.1 U26.1 U27.2 U28.2 USB1.5 X3.2 X3.3
VCC3V3: BOOT.1 BOOT.2 C3.2 C4.2 C14.2 H7.2 KEY2.1 LED1.2 PA.5 PB.1 R6.2 R7.2 R10.1 R14.2 SWD.1 U1.9 U1.24 U1.36 U1.48 U2.5 U9.20 U10.1 U14.1 U18.1 U19.2 U20.2 U25.2 U26.2 U27.1 U28.1
$1N38657: BOOT.3 R3.2
$1N38684: BOOT.4 R4.1

Pads without a net: U2 4; U10 3; USB1 4 6

## Via types
v1: diameter 0.61, hole 0.305, Top Layer to Bottom Layer, 183 vias

## Routing (per net, layer and track width the routed paths; a pad name or vN(x,y) marks a point on that pad's centre or on a via; arc(x,y) is an arc through that point)
5V/12V: length 36
  Top Layer w0.508: 47.24,25.02 D2.1 ; 47.24,25.02 49.53,25.02 49.78,25.27 D1.1 ; 47.24,25.02 v1(47.12,25.02) 47.12,16.44 46.37,15.69 43.79,15.69 U9.24 ; 41.66,22.68 39.24,22.68 C15.2 39.77,22.86 41.77,24.85 41.77,26.67 ; 41.66,22.68 41.66,23.01 U9.13 ; 41.66,22.68 41.66,22.35 41.66,22.36 U9.14
  Bottom Layer w0.508: v1(47.12,25.02) 43.31,25.02 41.66,26.67
12V: length 2.7
  Top Layer w0.508: 48.51,30.61 48.51,29.75 D2.2
+5V: length 54.1
  Top Layer w0.305: 61.8,19.66 60.73,19.66 60.45,19.94 60.19,19.69 58.29,19.69 C2.2 C1.2 61.77,18.61 61.8,18.64 ; 61.8,19.66 61.8,18.64 ; 61.8,19.66 68.96,19.66 68.96,20.29 69.21,20.54 U8.1 ; 61.8,19.66 61.8,24.76 63.23,26.19 63.91,26.19 64.13,26.42 64.13,31.83 63.83,32.13 49.91,32.13 49.78,32 D1.2 ; U2.1 62.68,17.69 61.88,17.69 61.8,17.6 ; 61.8,17.6 61.8,15.92 61.98,15.75 62.54,15.75 ; 61.8,17.6 61.8,18.64
GND: length 246.9
  Top Layer w0.152: U25.1 30.35,11.56 29.34,11.56 29.21,11.68 29.21,13.97 28.44,14.74 U1.8 ; U25.1 30.35,11.75 ; U25.1 31.31,11.62 v1(31.37,11.56) 32.32,11.56 U14.2 ; U19.1 20.38,18.8 v1(19.94,18.8) ; U19.1 21.08,18.1 U28.2 v1(17.27,18.1) ; U19.1 23.41,18.1 U1.47 ; U9.18 42.36,19.76 v1(42.04,19.43) ; C14.1 35.12,17.91 v1(33.91,17.91) ; H7.1 3.43,26.92 v1(5.97,26.92) v1(5.97,27.81) v1(5.97,28.83) PB.2 ; 23.5,28.83 21.62,28.83 21.46,28.68 ; 23.5,28.83 24.51,28.83 24.51,26.36 25.44,25.44 U1.35 25.44,23.15 v1(25.4,23.11) ; 23.5,28.83 v1(22.99,29.34) ; 23.5,28.83 U27.2 ; 50.7,17.81 50.61,17.71 U9.4 50.7,17.81 ; 50.7,17.81 52.48,17.81 ; 39.31,26.21 37.65,24.56 C15.1 36.9,22.86 U18.2 ; C12.1 25.85,4.7 v1(24.64,4.7) ; 52.83,18.16 v1(52.83,19.69) ; v1(46.61,6.1) 47.5,5.21 PA.13 ; SWD.4 72.53,31.75 71.59,31.75 71.27,32.07 64.5,32.07 64.01,32.56 47.17,32.56 46.35,31.75 46.35,28.83 45.47,27.94 45.45,27.95 41.23,27.95 41.22,27.94 v1(39.89,27.94) C16.2 ; C11.2 38.8,12.45 v1(38.8,12.45) ; C7.2 41.25,6.98 41.28,6.96 ; 21.46,28.68 v1(21.46,29.34) ; 21.46,28.68 U20.1 ; v1(58.29,15.99) v1(60.45,15.99) ; USB1.5 v1(72.9,24.29) ; U22.1 54.61,22.54 54.76,22.39 58.03,22.39 58.31,22.67
  Top Layer w0.203: 39.31,26.21 39.62,26.53 ; 39.62,26.53 39.77,26.67 ; 39.62,26.53 39.62,26.54 35.91,26.54 U26.1 ; v1(37.08,25.78) 36.66,26.21 U26.1 ; U26.1 35.58,24.13 ; 35.58,24.13 35.58,23.8 35.51,23.73 35.51,22.78 35.3,22.57 U1.23 ; 35.58,24.13 U18.2 v1(36.96,24.13)
  Top Layer w0.3: 50.51,20.95 48.64,20.95 v1(48.64,20.83) ; PA.4 24.64,2.29 24.26,1.91 18.92,1.91 18.34,2.49 18.34,4.11 19.05,4.83 v1(19.05,5.59) ; U9.9 U9.10
  Top Layer w0.305: 18.48,13.33 16.38,13.33 16.38,14.35 16,14.73 U23.2 ; 18.48,13.33 U13.2 v1(18.54,12.32) ; 18.48,13.33 20.89,13.33 U24.2 v1(20.96,12.32) ; C3.1 v1(67.44,14.99) ; C13.1 28.01,8.58 28.32,8.26 v1(28.32,8.25) 28.32,7.17 ; 64.9,3.81 v1(64.9,4.7) 64.9,7.24 BOOT.6 ; 64.9,3.81 v1(64.9,3.56) 64.9,2.79 64.71,2.6 63.44,2.6 ; 64.9,3.81 64.77,3.94 ; 72.9,28.45 72.9,28.33 72.76,28.19 ; 72.9,28.45 v1(74.04,28.45) ; 72.9,28.45 72.87,28.45 ; 72.9,28.45 72.9,29.34 73.34,29.78 SWD.4 ; C17.2 v1(52.07,8.89) ; v1(62.74,9.78) 64.64,9.78 BOOT.5 ; 52.83,18.16 51.83,17.16 U9.3 ; 15.49,7.31 15.49,9.65 15.82,9.98 ; 15.49,7.31 15.49,6.85 ; 15.49,7.31 v1(15.56,7.37) ; 15.49,7.31 14.28,6.1 U10.4 ; 15.82,9.98 v1(15.8,9.98) 15.49,10.29 15.49,11.05 v1(15.93,11.48) v1(18.8,11.48) v1(21.53,11.48) v1(24.46,11.48) ; 15.82,9.98 X3.2 ; v1(30.35,10.67) v1(31.37,10.67) v1(33.53,10.67) v1(33.53,12.19) 33.78,12.45 v1(38.8,12.45) v1(40.77,12.45) 41.28,11.94 41.28,11.05 ; 15.49,6.85 15.49,6.22 v1(16.13,5.59) v1(19.05,5.59) v1(20.45,5.59) ; 15.49,6.85 15.56,6.78 X3.3 ; v1(42.04,9.65) 41.33,9.65 v1(41.28,9.71) ; 41.28,11.05 v1(41.28,9.71) ; 41.28,11.05 C8.2 ; v1(41.28,9.71) v1(41.28,8.38) v1(41.28,5.97) 38.1,5.97 v1(37.72,5.59) v1(33.91,5.59) 33.66,5.84 33.66,6.98 v1(33.53,7.11) 33.4,7.24 v1(29.97,7.24) 28.39,7.24 28.32,7.17 ; v1(43.18,5.33) 43.83,5.33 44.32,5.83 ; v1(59.94,2.54) 61.28,2.54 C18.1 63.44,2.6 ; R1.2 v1(75.57,14.22) ; 28.32,7.17 C12.1 ; U2.2 v1(63.88,16.76) ; v1(63.5,2.54) 63.44,2.6 ; C4.1 v1(69.6,14.99) ; v1(24.64,4.7) PA.4 ; 60.45,17.16 v1(60.45,15.99) ; 58.29,17.16 v1(58.29,15.99)
  Bottom Layer w0.152: v1(28.07,18.03) 27.94,18.16 27.94,20.38 25.71,22.62 25.71,22.81 v1(25.4,23.11) ; v1(48.64,20.83) 48.51,20.83 ; v1(33.91,17.91) 33.91,18.03
  Bottom Layer w0.305: U10.4 v1(12.45,4.19) ; v1(42.04,9.65) 41.91,9.65 ; v1(67.44,14.99) 67.44,14.86
  vias: v1(4.97,28.83) v1(4.95,27.81) v1(12.19,12.06) v1(12.19,11.18) v1(12.19,10.29) v1(12.19,9.27) v1(13.08,12.06) v1(13.08,11.18) v1(13.08,10.29) v1(13.08,9.27) v1(13.46,12.95) v1(15.49,26.42) v1(15.49,12.95) v1(15.49,12.19) v1(15.88,27.18) v1(16.38,26.42) v1(16.89,27.18) v1(37.85,25.53) v1(45.21,28.58) v1(45.85,31.62) v1(45.85,30.61) v1(49.02,9.4) v1(55.25,9.4) v1(64.64,13.84) v1(64.64,12.95) v1(65.79,4.7) v1(66.42,3.56) v1(66.51,13.84) v1(66.55,12.95) v1(67.95,3.56) v1(68.5,13.84) v1(69.29,3.56) v1(70.16,4.67) v1(70.22,13.84) v1(71.02,4.67) v1(71.02,3.56) v1(75.06,31.62) v1(75.06,30.73) v1(75.06,29.84) v1(75.82,31.62) v1(75.82,30.73) v1(75.82,29.84)
VCC3V3: length 275.5
  Top Layer w0.305: U9.20 43.51,18.57 42.51,18.57 42.31,18.77 41.3,18.77 v1(41.28,18.8) ; v1(33.02,26.21) U26.2 34.24,26.14 34.24,23.73 ; U27.1 23.5,25.38 23.54,25.33 ; 21.66,25.33 21.47,25.15 21.46,25.15 v1(21.46,25.27) ; 21.66,25.33 21.46,25.53 U20.2 ; 21.66,25.33 23.54,25.33 ; v1(31.1,2.54) 31.1,3.78 31.12,3.79 v1(31.12,5.97) ; 67.33,26.9 64.92,26.9 v1(64.9,26.92) ; 67.33,26.9 67.59,26.64 71.75,26.64 73.56,24.84 73.56,21.13 71.58,19.15 71.58,17.92 70.99,17.34 ; 67.33,26.9 67.17,27.06 R6.2 ; U28.1 18.67,16.7 U19.2 21.14,16.64 22.1,16.64 22.48,17.02 22.48,17.4 22.65,17.57 U1.48 ; 34.24,23.73 33.58,23.07 U1.24 ; 34.24,23.73 34.18,23.8 ; U1.9 28.94,15.01 29.46,14.48 30.23,14.48 30.48,14.22 30.48,13.4 32.32,13.4 32.51,13.21 v1(34.67,13.21) 34.43,13.45 34.43,14.86 ; BOOT.2 72.9,7.37 72.9,9.85 ; KEY2.1 48.77,5.58 v1(48.77,4.06) ; 70.99,17.34 70.99,15 71.3,14.69 LED1.2 72.9,14.61 72.9,9.85 ; 70.99,17.34 70.61,17.72 65.43,17.72 ; 72.9,9.85 72.84,9.91 BOOT.1 ; 24.08,25.33 24.13,25.28 v1(24.13,24.51) ; 24.08,25.33 23.54,25.33 ; 24.08,25.33 24.77,25.33 24.94,25.16 U1.36 ; 67.18,28.32 67.18,29.34 66.17,29.34 65.91,29.59 65.91,30.75 SWD.1 ; v1(32.41,16) 32.41,16.44 32.81,16.85 35.92,16.85 36.72,17.65 C14.2 37.03,17.91 v1(38.1,17.91) ; 63.23,27.68 v1(63.23,26.92) ; v1(31.37,14.35) 33.66,14.35 R7.2 ; R10.1 5.59,10.41 4.95,9.78 4.95,6.22 U10.1
  Top Layer w0.4: v1(72.39,2.03) 72.39,3.48
  Top Layer w0.45: v1(27.18,1.91) PA.5 ; v1(17.4,16.64) 18.61,16.64 U28.1
  Bottom Layer w0.305: v1(38.1,17.91) 40.39,17.91 v1(41.28,18.8) ; 31.08,1.65 31.12,1.69 31.12,2.54 v1(31.1,2.54) ; v1(24.13,24.51) 25.61,24.51 27.31,26.21 v1(33.02,26.21) ; v1(21.46,25.27) 21.21,25.53 4.57,25.53 H7.2 ; v1(32.41,16) 32.41,15.39 v1(31.37,14.35) ; 33.48,13.08 33.61,13.21 v1(34.67,13.21) 34.32,12.85 33.25,12.85 32.87,12.47 32.87,8.69 31.12,6.94 v1(31.12,5.97) ; v1(64.9,26.92) v1(63.23,26.92)
  Bottom Layer w0.45: 4.83,2.54 1.9,5.47 1.9,23.61 2.41,24.13 H7.2 1.9,25.41 1.9,30.34 2.54,30.99 PB.1 ; 4.83,2.54 U10.1 ; 4.83,2.54 5.72,1.65 14.22,1.65 ; v1(17.4,16.64) 14.22,13.46 14.22,1.65 ; 14.22,1.65 26.92,1.65 v1(27.18,1.91) ; v1(72.39,2.03) 72.01,1.65 48.77,1.65 ; 48.77,1.65 27.18,1.65 ; 48.77,1.65 v1(48.77,4.06)
VCC_BAT: length 12.5
  Top Layer w0.305: 24.89,16.2 24.89,15.24 24.32,14.67 U24.1 U13.1 17.33,14.67 16.89,15.11 16.89,16 16.64,16.26 U23.1
AO1: length 23
  Top Layer w0.152: U9.1 50.63,15.88 52.45,15.88 52.63,16.05 52.63,16.51 ; 58.67,30.61 58.67,29.36 58.52,29.21 55.5,29.21 53.47,27.18 53.47,17.34 52.63,16.51 ; 52.63,16.51 U9.2
AO2: length 16.7
  Top Layer w0.152: 56.13,30.61 52.07,26.54 52.07,19.18 52,19.11 ; 52,19.11 U9.6 ; 52,19.11 52.07,19.04 52.07,18.54 51.94,18.41 50.65,18.41 U9.5
BO1: length 13.8
  Top Layer w0.152: 49.15,22.61 48.9,22.86 48.9,23.88 49.91,23.88 51.69,25.66 51.69,27.3 53.59,29.21 53.59,30.61 ; 49.15,22.61 49.55,23.01 U9.12 ; 49.15,22.61 49.4,22.36 U9.11
BO2: length 17.2
  Top Layer w0.152: 49.28,20.07 49.62,20.41 U9.8 ; 49.28,20.07 49.53,19.81 50.55,19.81 U9.7 ; 49.28,20.07 47.65,20.07 47.65,23.37 48.67,24.38 49.91,24.38 51.05,25.53 51.05,30.61
BOOT0: length 50.2
  Top Layer w0.152: 18.67,27.3 18.67,20.45 18.92,20.19 21.72,20.19 22.34,19.57 U1.44
  Top Layer w0.305: U1.44 23.45,19.56 24.25,19.56 24.89,18.92 v1(24.89,18.8) ; R3.1 v1(53.21,15.97)
  Bottom Layer w0.305: v1(53.21,15.97) 53.21,15.28 54.38,14.12 54.38,13.57 53.99,13.18 52.6,13.18 48.54,17.25 27.76,17.25 26.21,18.8 v1(24.89,18.8)
BOOT1: length 2.5
  Top Layer w0.305: R4.2 33.66,21.46 33.26,21.07 U1.20
BP5_RES: length 38.4
  Top Layer w0.152: H7.5 4.7,16.51 5.21,17.02 5.21,18.03 8.24,21.07 v1(16.13,21.07) ; v1(26.29,21.08) 26.28,21.07 U1.41 22.36,21.07 22.1,21.34 19.94,21.34 19.81,21.46 19.81,27.43
  Bottom Layer w0.152: v1(16.13,21.07) 16.35,20.85 26.06,20.85 v1(26.29,21.08)
OSCIN_8: length 19.6
  Top Layer w0.152: U1.5 26.94,11.93 27.94,10.92 28.83,10.92 29.08,10.67 29.08,8.64 29.59,8.13 31.87,8.13 R2.2 34.64,8.14 X2.2 39.16,6.97 C7.1
OSCOUT_8: length 17.9
  Top Layer w0.152: U1.6 27.44,11.93 28.07,11.3 28.96,11.3 29.46,10.8 29.46,10.03 29.84,9.65 31.87,9.65 R2.1 34.39,9.64 X2.1 39.16,11.07 C8.1
PA0_WKUP: length 49.2
  Top Layer w0.152: KEY2.2 46.34,13.73 45.34,14.73 42.64,14.73 41.9,15.47 41.9,15.76 41.66,15.99 34.03,15.99 33.05,15.01 29.79,15.01 29.44,15.37 U1.10
  Top Layer w0.305: v1(29.72,5.21) PA.6 ; KEY2.2 48.25,12.95 v1(47.88,12.95)
  Bottom Layer w0.305: v1(29.72,5.21) 31.58,5.21 32.62,6.25 37.49,6.25 38.96,7.72 43.02,7.72 43.05,7.75 43.05,12.06 43.43,12.45 47.37,12.45 v1(47.88,12.95)
PA1_ADC: length 88.8
  Top Layer w0.152: v1(55.25,26.16) 55.23,26.16 55.22,26.15 ; R14.1 58.54,27.68 58.31,27.45 58.31,26.07 58.24,26.15 55.22,26.15 ; U22.2 54.61,26 54.76,26.15 55.22,26.15 ; U1.11 29.94,17.09 29.78,17.25 29.25,17.25 28.83,17.66 v1(28.83,18.41)
  Top Layer w0.2: 29.94,17.09 29.97,17.12 30.63,17.12 31.24,16.51 v1(31.75,16.51)
  Top Layer w0.305: v1(32.38,5.08) 32.38,3.43 PA.7
  Bottom Layer w0.152: v1(28.83,18.41) 28.83,20.24 29.6,21.01 36.12,21.01 37.03,21.92 54.81,21.92 55.25,22.35 v1(55.25,26.16)
  Bottom Layer w0.305: v1(32.38,5.08) 33.48,5.08 33.64,4.93 41.76,4.93 48.77,11.94 48.54,12.17 48.54,13.23 48.15,13.61 40.36,13.61 37.24,16.74 32.11,16.74 31.88,16.51 v1(31.75,16.51)
PA2_PWMA: length 45.8
  Top Layer w0.152: U1.12 30.44,15.37 32.89,15.37 33.88,16.35 42.58,16.35 42.78,16.55 43.32,16.55 43.37,16.51
  Top Layer w0.2: 42.58,16.35 42.28,16.06 42.28,15.63 42.78,15.14 45.95,15.14 46.31,14.78 49.65,14.78 49.82,14.6 49.82,12.85 49.65,12.68 48.84,12.68 41.15,4.98 39.65,4.98 38.61,3.94 38.61,2.41 38.01,2.41 37.79,2.2 36.88,2.2 35.78,3.3 PA.8 ; 43.37,16.51 U9.23
PA3_PWMB: length 45.6
  Top Layer w0.152: v1(26.42,17.65) 27.81,19.05 v1(29.46,19.05) 29.46,18.03 29.93,17.57 U1.13 ; PA.9 35.64,5 33.67,5 32.02,6.66 29.9,6.66 v1(29.34,6.1) ; 43.37,21.71 41.77,21.71 v1(40.89,20.83)
  Bottom Layer w0.152: v1(26.42,17.65) 26.42,14.1 29.46,11.05 29.46,10.67 29.34,10.54 v1(29.34,6.1) ; v1(40.89,20.83) 40.72,20.65 29.74,20.65 29.46,20.37 v1(29.46,19.05)
PA4_AIN1: length 41.5
  Top Layer w0.152: PA.10 41.18,4.6 41.3,4.6 49,12.3 49.8,12.3 50.55,13.04 v1(50.55,13.97) ; v1(34.8,19.18) 35.05,19.43 39.37,19.43 40.81,17.99 43.18,17.99 43.37,17.81 ; v1(48.64,17.91) v1(48.64,16.13) ; v1(30.23,18.54) 30.7,18.07 U1.14 ; v1(45.34,17.91) 43.73,17.91 U9.21
  Bottom Layer w0.152: v1(48.64,17.91) v1(45.34,17.91) ; v1(50.55,13.97) 50.55,14.22 v1(48.64,16.13) ; v1(30.23,18.54) 34.16,18.54 v1(34.8,19.18)
PA5_AIN2: length 36.9
  Top Layer w0.152: 43.37,17.16 42.77,17.16 42.47,17.45 40.84,17.45 39.7,18.59 31.96,18.59 U1.15 ; v1(47.24,15.49) 49.4,15.49 49.66,15.24 50.1,15.24 51.13,14.21 51.13,12.78 46.03,7.67 46.03,4.62 45.85,4.44 43.06,4.44 42.42,3.8 PA.11 ; U9.22 44.49,17.16 45.13,16.51 v1(45.34,16.51)
  Bottom Layer w0.152: v1(47.24,15.49) 46.35,15.49 v1(45.34,16.51)
PA6_BIN1: length 42
  Top Layer w0.152: 43.37,20.41 42,20.41 41.4,19.81 34.16,19.81 33.91,19.56 33.91,19.05 31.96,19.05 U1.16
  Top Layer w0.305: U9.17 45.63,20.41 v1(45.72,20.32)
  Bottom Layer w0.305: v1(45.72,20.32) 46.1,19.94 50.59,19.94 54.89,15.64 54.89,13.23 PA.12
PA7_BIN2: length 12.3
  Top Layer w0.152: 43.37,21.06 42.01,21.06 41.15,20.19 33.68,20.19 33.53,20.04 33.53,19.56 31.95,19.56 U1.17
PA8_STBY: length 37.5
  Top Layer w0.152: PB.13 33.91,28.83 33.53,28.45 29.06,28.45 28.52,27.91 28.52,24.66 U1.29 28.45,24.56 v1(28.45,23.24)
  Top Layer w0.305: v1(43.31,24.13) 43.81,23.62 45.09,23.62 46.48,22.22 46.48,19.56 46.03,19.11 U9.19
  Bottom Layer w0.305: v1(28.45,23.24) 28.6,23.39 37.15,23.39 37.89,24.13 v1(43.31,24.13)
PA9: length 9
  Top Layer w0.152: U1.30 27.94,24.57 27.94,28.45 28.32,28.83 30.99,28.83 31.37,29.21 31.37,30.61
PA10: length 7
  Top Layer w0.152: U1.31 27.43,24.57 27.43,28.83 27.81,29.21 28.45,29.21 28.83,29.59 28.83,30.61
PA11_D-: length 55.8
  Top Layer w0.152: v1(27.18,22.86) 26.94,23.1 U1.32 26.92,24.58 26.92,29.22 26.29,29.86 26.29,30.61 ; v1(65.28,25.53) R8.2
  Bottom Layer w0.152: v1(27.18,22.86) 27.43,22.61 50.42,22.61 54.97,27.36 55.45,27.36 56.73,28.7 57.28,28.71 57.28,27.56 58.01,27.56 58.17,27.71 58.17,28.83 59.69,28.83 60.2,28.32 61.59,28.32 62.1,28.83 64.26,28.83 65.66,27.43 65.66,25.91 v1(65.28,25.53)
PA12_D+: length 58.4
  Top Layer w0.152: U8.2 65.53,21.08 65.28,21.34 v1(65.28,23.11) 65.29,23.13 66.42,23.13 ; U1.33 26.44,23.01 v1(26.29,22.86) ; 26.52,24.65 26.52,28.6 25.91,29.21 23.96,29.21 23.75,29.42 23.75,30.61
  Bottom Layer w0.152: v1(26.29,22.86) 26.29,22.73 26.75,22.28 50.53,22.28 55.31,27.05 61.34,27.05 v1(65.28,23.11)
PA15_DHT11: length 30.7
  Top Layer w0.152: v1(21.97,22.99) 22.39,22.57 U1.38 ; v1(12.95,18.92) 10.41,18.92 10.11,18.62 R10.2 10.11,8.76 9.61,8.25 7.87,8.25 7.37,7.75 U10.2
  Bottom Layer w0.152: v1(12.95,18.92) 12.95,20.07 15.88,22.99 v1(21.97,22.99)
PB0_KEY0: length 42.5
  Top Layer w0.152: U1.18 31.93,20.07 v1(30.35,20.07) ; v1(53.72,13.84) 55.23,13.84
  Top Layer w0.305: KEY3.2 51.26,9.88 51.26,4.53 PA.14
  Bottom Layer w0.152: v1(30.35,20.07) 43.31,20.07 43.87,19.51 48.95,19.51 52.32,16.13 52.32,15.24 v1(53.72,13.84) 53.53,13.84
PB1_KEY1: length 63.6
  Top Layer w0.152: v1(48.64,27.05) 42.93,27.05 42.38,27.6 41.38,27.6 40.84,27.05 40.84,25.89 38.35,23.41 38.35,20.7 38.22,20.57 U1.19 ; KEY4.2 59.4,14.4 56.46,14.4 55.5,15.37 55.5,17.14 54.61,18.03 54.61,21.94 53.88,22.67 53.88,25.77 55.5,27.39 v1(55.5,28.32)
  Top Layer w0.305: PA.15 54.13,4.85 55.89,4.85 60.07,9.03 KEY4.2
  Bottom Layer w0.152: v1(55.5,28.32) 51.18,28.32 49.91,27.05 v1(48.64,27.05)
PB3_D0: length 34.3
  Top Layer w0.152: 21.21,30.61 20.7,30.1 20.7,22.99 21.59,22.1 23.41,22.1 U1.39 24.48,22.07 v1(24.76,22.35) ; 3.17,21.59 4.67,21.59 5.44,22.35 v1(16.13,22.35)
  Bottom Layer w0.152: v1(24.76,22.35) v1(16.13,22.35)
PB4_D1: length 37.8
  Top Layer w0.152: v1(25.27,21.72) 25.13,21.57 U1.40 22.37,21.57 22.25,21.69 20.47,21.69 20.32,21.84 20.32,27.94 18.67,29.59 18.67,30.61 ; H7.4 5.46,19.05 8.13,21.72 v1(16.76,21.72)
  Bottom Layer w0.152: v1(25.27,21.72) v1(16.76,21.72)
PB6_DC: length 47.2
  Top Layer w0.152: v1(16.76,20.19) 16.47,20.49 8.42,20.49 5.59,17.65 5.59,14.48 5.08,13.97 H7.6 ; 16.13,30.61 16.13,29.39 18.36,29.39 19.43,28.32 19.43,21.08 19.56,20.95 21.97,20.95 22.35,20.57 U1.42 25.91,20.57 v1(26.29,20.19)
  Bottom Layer w0.152: v1(16.76,20.19) v1(26.29,20.19)
PB7_CS: length 50.8
  Top Layer w0.152: 13.59,30.61 13.59,29.21 13.77,29.03 17.96,29.03 19.02,27.97 19.02,20.73 19.18,20.57 21.84,20.57 22.35,20.07 U1.43 25.01,20.07 v1(25.53,19.56) ; H7.7 5.33,11.43 5.97,12.06 5.97,17.4 8.64,20.07 15.62,20.07 v1(16.13,19.56)
  Bottom Layer w0.152: v1(16.13,19.56) v1(25.53,19.56)
PB8: length 22.7
  Top Layer w0.152: U1.45 22.23,19.07 21.49,19.81 18.67,19.81 18.29,20.19 18.29,28.06 17.67,28.68 11.33,28.68 11.05,28.96 11.05,30.61
PB9: length 25.6
  Top Layer w0.152: 8.51,30.61 8.51,28.83 9.02,28.32 17.53,28.32 17.91,27.94 17.91,19.94 18.42,19.43 21.36,19.43 22.22,18.57 U1.46
PB10: length 53.1
  Top Layer w0.152: U1.21 29.06,21.57 25.4,17.91 v1(25.4,17.53) 25.53,17.4
  Bottom Layer w0.152: PA.16 53.52,4.9 47.57,4.9 46.42,3.75 46.42,3.24 45.41,2.22 44.51,2.22 43.88,2.85 43.88,3.24 43.69,3.43 43.69,3.94 43.24,4.38 28.64,4.38 27.69,5.33 27.69,11.49 27.47,11.71 27.47,12.28 25.4,14.35 v1(25.4,17.53)
PB11: length 58.4
  Top Layer w0.152: 28.19,21.72 27.51,21.03 27.51,20.59 24.64,17.72 24.64,17.53 23.37,16.26 v1(23.37,15.88) ; 28.19,21.72 28.46,21.98 31.85,21.98 U1.22 ; 28.19,21.72 28.07,21.72
  Top Layer w0.305: PA.17 57.66,1.65 57.53,1.52 30.1,1.52 29.48,2.15 29.24,2.15 28.56,2.82 28.56,3.55 27.66,4.46 27.66,4.47 v1(27.43,4.7)
  Bottom Layer w0.152: v1(23.37,15.88) 27.11,12.13 27.11,11.56 27.25,11.42 27.25,4.88 v1(27.43,4.7)
PB12: length 18.1
  Top Layer w0.152: PB.17 43.94,30.86 v1(43.94,28.58) ; U1.25 v1(31.37,24.57)
  Bottom Layer w0.152: v1(31.37,24.57) 36.57,24.57 36.72,24.71 39.27,24.71 40.84,26.28 40.84,27.05 42.36,28.58 v1(43.94,28.58)
PB13: length 16.1
  Top Layer w0.152: 41.53,30.61 41.53,29.46 41.15,29.08 39.62,29.08 37.72,27.18 30.23,27.18 29.94,26.89 U1.26
PB14: length 14.5
  Top Layer w0.152: U1.27 29.44,27.4 29.72,27.69 37.47,27.69 38.99,29.21 38.99,30.61
PB15: length 12.8
  Top Layer w0.152: 36.45,30.61 36.45,29.08 35.46,28.09 29.21,28.09 28.94,27.82 U1.28
PC13: length 19.7
  Top Layer w0.305: v1(22.35,13.59) 24.38,13.59 25.44,14.64 U1.2
  Bottom Layer w0.305: PA.1 17.14,3.43 17.14,4.44 17.65,4.95 17.68,4.93 21.48,4.93 22.22,5.67 22.22,8.13 22.19,8.16 22.19,13.43 v1(22.35,13.59)
PC14_32.768: length 18
  Top Layer w0.152: 25.94,9.91 24.77,9.91 ; 25.94,9.91 U1.3 ; 25.94,9.91 C13.2 27.12,9.91 ; 24.77,9.91 23.15,9.91 X3.1 ; 24.77,9.91 24.76,9.9 24.76,6.22 23.62,5.08 22.61,5.08 22.22,4.7 22.22,3.81
PC15_32.768: length 19
  Top Layer w0.152: v1(26.67,8.89) 26.67,6.92 C12.2 v1(25.91,6.86) ; v1(24,6.86) 23.15,6.86 X3.4 23.07,5.67 22.83,5.44 22.45,5.44 21.72,4.7 20.19,4.7 19.56,4.06 PA.2 ; v1(26.67,11.18) 26.67,11.2 26.44,11.43 U1.4
  Bottom Layer w0.152: v1(25.91,6.86) v1(24,6.86) ; v1(26.67,8.89) v1(26.67,11.18)
RESET: length 29.1
  Top Layer w0.152: U1.7 27.94,15.12 28.07,14.99 v1(28.07,13.59) ; 41.78,13.83 41.77,13.84 C11.1 ; 41.78,13.83 v1(41.78,12.83) 43.55,12.83 44.32,13.6 ; 41.78,13.83 41.78,14.73 41.66,14.86 35.93,14.86
  Bottom Layer w0.152: 28.07,13.46 28.32,13.72 33.53,13.72 33.6,13.79 39.42,13.79 40.13,13.08 41.4,13.08 41.78,12.7
SWCLK: length 55.5
  Top Layer w0.305: U1.37 23.62,23.26 v1(23.62,23.75) ; R5.2 71.26,29.58 v1(71.25,29.59) 71.25,30.49 SWD.3
  Bottom Layer w0.305: v1(23.62,23.75) 23.37,24 23.37,26.03 27.1,29.77 41.94,29.77 42.15,29.97 42.16,29.97 42.3,29.83 44.55,29.83 44.56,29.84 64.57,29.84 64.83,29.59 v1(71.25,29.59)
SWDIO: length 51.1
  Top Layer w0.152: U1.34 25.94,25.75 v1(25.91,25.78)
  Top Layer w0.305: v1(68.68,27.3) R6.1 68.68,28.98 68.26,29.41 SWD.2
  Bottom Layer w0.305: 26.16,25.78 25.91,26.03 25.91,27.43 27.74,29.26 64.44,29.26 66.4,27.3 v1(68.68,27.3)
$1N4524: length 2.7
  Top Layer w0.305: 75.57,16.62 75.3,16.89 LED1.1
$1N8192: length 5.8
  Top Layer w0.152: USB1.2 70.88,22.34 70.43,22.78 70.43,24.82 69.72,25.53 R8.1
$1N8237: length 5.7
  Top Layer w0.152: R9.1 68.56,22.99 v1(69.85,22.99) ; v1(72.9,22.99) USB1.3
  Bottom Layer w0.152: v1(72.9,22.99) v1(69.85,22.99)
$1N32184: length 3.3
  Top Layer w0.152: KEY3.1 52.27,5.96 C17.1
$1N32195: length 3
  Top Layer w0.152: C18.2 61.34,5.59 61.1,5.83 KEY4.1
$1N38657: length 14.8
  Top Layer w0.305: R3.2 56.68,15.97 57.82,14.83 60.72,14.83 63.36,12.19 67.06,12.19 67.31,11.94 BOOT.3
$1N38684: length 46.8
  Top Layer w0.305: v1(37.59,21.34) 36.06,21.34 35.81,21.59
  Bottom Layer w0.305: v1(37.59,21.34) 40.47,21.34 40.62,21.49 57.4,21.49 57.93,20.95 59.31,20.95 59.31,8.89 62.48,5.71 67.06,5.71 67.31,5.97 BOOT.4

## Copper pours and planes (outline as drawn; the poured copper is in the pictures)
+5V on Top Layer: 72.52,21.72 72.14,21.34 71.22,21.34 70.96,21.08 70.74,21.08 70.36,20.7 69.98,20.7 69.85,20.57 68.78,20.57 68.78,21.67 68.83,21.72 70.23,21.72 70.49,21.97 72.39,21.97 72.52,21.84
+5V on Top Layer: 57.28,17.9 60.97,17.9 61.47,17.4 62.48,17.4 62.61,17.27 63.44,17.27 63.44,18.46 62.85,19.05 62.61,19.05 62.36,19.3 62.36,20.32 59.69,20.32 59.44,20.57 57.28,20.57
GND on Top Layer: -5.21,36.45 85.98,36.45 85.98,-2.92 -5.21,-2.92
GND on Bottom Layer: -3.3,35.18 78.74,35.18 78.74,-1.78 -3.3,-1.78
VCC3V3 on Top Layer: 64.91,18.8 64.91,17.66 64.52,17.27 64.62,17.16 67.68,17.16 67.84,17.01 71.37,17.01 71.37,17.02 71.37,18.16 70.74,18.8
VCC3V3 on Top Layer: 71.75,15.62 71.75,12.7 71.88,12.57 71.88,2.82 76.12,2.82 76.12,12.77 74.52,14.38 74.52,15.59 74.55,15.62

Small or netless copper shapes (teardrops, artwork), in the pictures only: 481 on Top Layer, 100 on Bottom Layer

## Text on the board
Top Silkscreen Layer: GND | PB8 | PB7 | PB6 | PC13 | PB4 | PC15 | PB3 | PC14 | PA12 | PA13 | VCC | PA10 | PA0 | PA9 | PA1 | PA8 | PA2 | PB15 | PA3 | PB14 | PA4 | PB13 | PA5 | PB12 | PA6 | 12V | PB0 | BO2 | PB1 | BO1 | PB10 | AO2 | PB11 | AO1 | PA15 / DHT11 | x | vcc | PB7 / CS | CLK | PB5 / RES | PB4 / D1 | PB6 / DC | PB3 / D0 | DIO | GitHub: / GoKo-Son626 | DHT11
